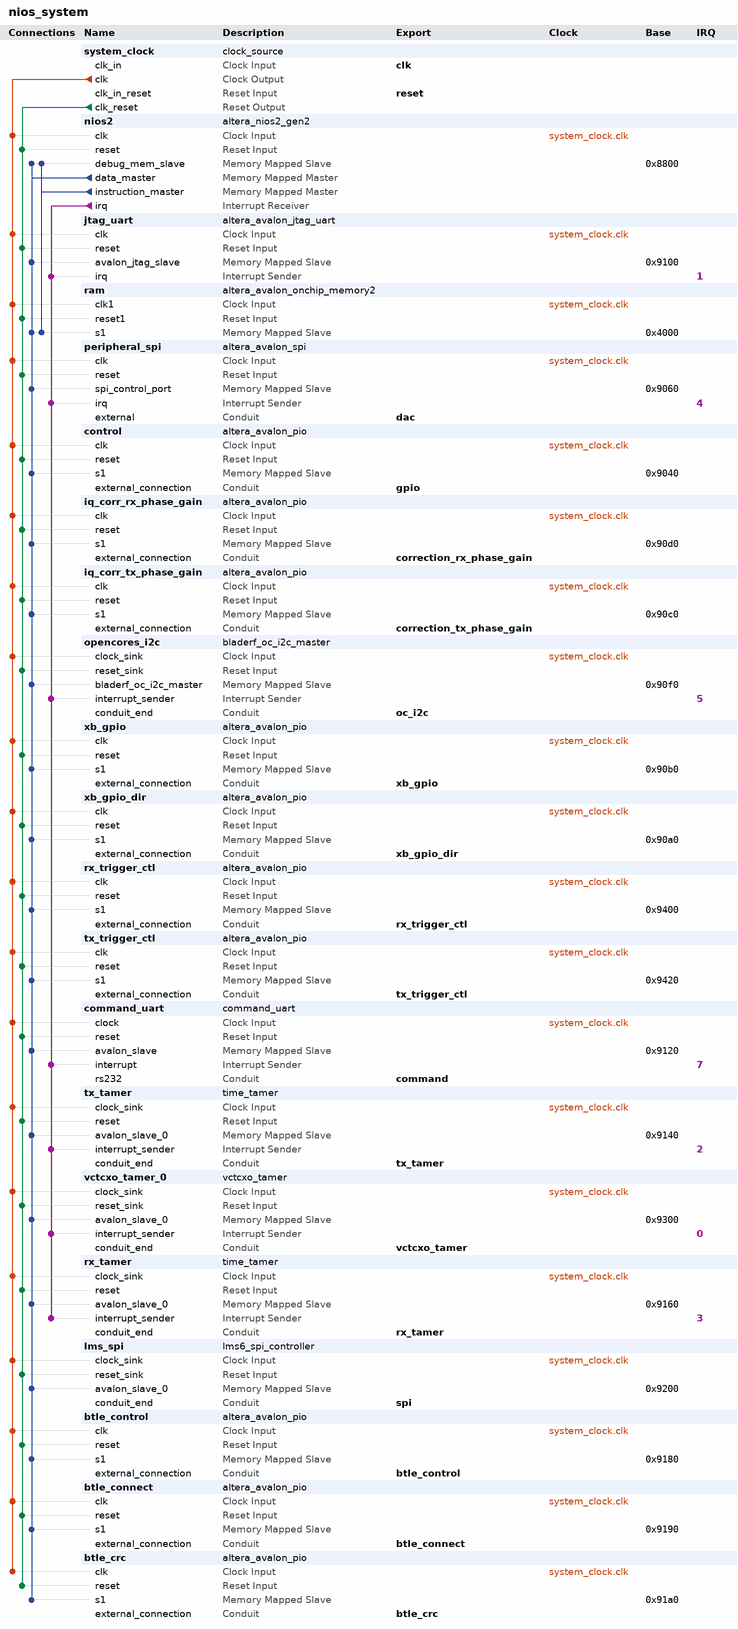
[diagram p0: system contents]
# Platform Designer (Qsys) system nios_system, Cyclone IV E EP4CE115F23C8
# Parameters at their usual value, and those the tool derives, are not listed.
package require -exact qsys 15.0
create_system nios_system
set_project_property DEVICE_FAMILY {Cyclone IV E}
set_project_property DEVICE EP4CE115F23C8

add_instance system_clock clock_source 15.0
set_instance_parameter_value system_clock clockFrequency 80000000
set_instance_parameter_value system_clock resetSynchronousEdges DEASSERT

add_instance nios2 altera_nios2_gen2 15.0
set_instance_parameter_value nios2 dcache_size 2048
set_instance_parameter_value nios2 dividerType srt2
set_instance_parameter_value nios2 exceptionSlave ram.s1
set_instance_parameter_value nios2 icache_size 2048
set_instance_parameter_value nios2 impl Tiny
set_instance_parameter_value nios2 mul_64_impl 1
set_instance_parameter_value nios2 mul_shift_choice 1
set_instance_parameter_value nios2 resetSlave ram.s1
set_instance_parameter_value nios2 setting_activateTrace true

add_instance jtag_uart altera_avalon_jtag_uart 15.0
set_instance_parameter_value jtag_uart simInteractiveOptions INTERACTIVE_INPUT_OUTPUT

add_instance ram altera_avalon_onchip_memory2 15.0
set_instance_parameter_value ram allowInSystemMemoryContentEditor true
set_instance_parameter_value ram dataWidth 32
set_instance_parameter_value ram dualPort false
set_instance_parameter_value ram initMemContent true
set_instance_parameter_value ram initializationFileName onchip_memory2_0
set_instance_parameter_value ram instanceID MED
set_instance_parameter_value ram memorySize 16384

add_instance peripheral_spi altera_avalon_spi 15.0
set_instance_parameter_value peripheral_spi clockPhase 1
set_instance_parameter_value peripheral_spi clockPolarity 1
set_instance_parameter_value peripheral_spi dataWidth 8
set_instance_parameter_value peripheral_spi masterSPI true
set_instance_parameter_value peripheral_spi numberOfSlaves 2
set_instance_parameter_value peripheral_spi targetClockRate 9600000

add_instance control altera_avalon_pio 15.0
set_instance_parameter_value control bitModifyingOutReg true
set_instance_parameter_value control direction Output
set_instance_parameter_value control width 32

add_instance iq_corr_rx_phase_gain altera_avalon_pio 15.0
set_instance_parameter_value iq_corr_rx_phase_gain direction Output
set_instance_parameter_value iq_corr_rx_phase_gain width 32

add_instance iq_corr_tx_phase_gain altera_avalon_pio 15.0
set_instance_parameter_value iq_corr_tx_phase_gain direction Output
set_instance_parameter_value iq_corr_tx_phase_gain resetValue 1
set_instance_parameter_value iq_corr_tx_phase_gain width 32

add_instance opencores_i2c bladerf_oc_i2c_master 1.0
set_instance_parameter_value opencores_i2c ARST_LVL 1

add_instance xb_gpio altera_avalon_pio 15.0
set_instance_parameter_value xb_gpio direction InOut
set_instance_parameter_value xb_gpio width 32

add_instance xb_gpio_dir altera_avalon_pio 15.0
set_instance_parameter_value xb_gpio_dir direction Output
set_instance_parameter_value xb_gpio_dir width 32

add_instance rx_trigger_ctl altera_avalon_pio 15.0
set_instance_parameter_value rx_trigger_ctl bitModifyingOutReg true
set_instance_parameter_value rx_trigger_ctl direction InOut
set_instance_parameter_value rx_trigger_ctl width 8

add_instance tx_trigger_ctl altera_avalon_pio 15.0
set_instance_parameter_value tx_trigger_ctl bitModifyingOutReg true
set_instance_parameter_value tx_trigger_ctl direction InOut
set_instance_parameter_value tx_trigger_ctl width 8

add_instance command_uart command_uart 1.0

add_instance tx_tamer time_tamer 1.0

add_instance vctcxo_tamer_0 vctcxo_tamer 1.0

add_instance rx_tamer time_tamer 1.0

add_instance lms_spi lms6_spi_controller 1.0
set_instance_parameter_value lms_spi ADDR_WIDTH 8
set_instance_parameter_value lms_spi CLOCK_DIV 4
set_instance_parameter_value lms_spi DATA_WIDTH 8

add_instance btle_control altera_avalon_pio 15.0
set_instance_parameter_value btle_control direction Output
set_instance_parameter_value btle_control width 32

add_instance btle_connect altera_avalon_pio 15.0
set_instance_parameter_value btle_connect direction Output
set_instance_parameter_value btle_connect width 32

add_instance btle_crc altera_avalon_pio 15.0
set_instance_parameter_value btle_crc direction Output
set_instance_parameter_value btle_crc width 24

# connections
add_connection system_clock.clk btle_connect.clk clock
add_connection system_clock.clk btle_control.clk clock
add_connection system_clock.clk btle_crc.clk clock
add_connection system_clock.clk command_uart.clock clock
add_connection system_clock.clk control.clk clock
add_connection system_clock.clk iq_corr_rx_phase_gain.clk clock
add_connection system_clock.clk iq_corr_tx_phase_gain.clk clock
add_connection system_clock.clk jtag_uart.clk clock
add_connection system_clock.clk lms_spi.clock_sink clock
add_connection system_clock.clk nios2.clk clock
add_connection system_clock.clk opencores_i2c.clock_sink clock
add_connection system_clock.clk peripheral_spi.clk clock
add_connection system_clock.clk ram.clk1 clock
add_connection system_clock.clk rx_tamer.clock_sink clock
add_connection system_clock.clk rx_trigger_ctl.clk clock
add_connection system_clock.clk tx_tamer.clock_sink clock
add_connection system_clock.clk tx_trigger_ctl.clk clock
add_connection system_clock.clk vctcxo_tamer_0.clock_sink clock
add_connection system_clock.clk xb_gpio.clk clock
add_connection system_clock.clk xb_gpio_dir.clk clock
add_connection system_clock.clk_reset btle_connect.reset reset
add_connection system_clock.clk_reset btle_control.reset reset
add_connection system_clock.clk_reset btle_crc.reset reset
add_connection system_clock.clk_reset command_uart.reset reset
add_connection system_clock.clk_reset control.reset reset
add_connection system_clock.clk_reset iq_corr_rx_phase_gain.reset reset
add_connection system_clock.clk_reset iq_corr_tx_phase_gain.reset reset
add_connection system_clock.clk_reset jtag_uart.reset reset
add_connection system_clock.clk_reset lms_spi.reset_sink reset
add_connection system_clock.clk_reset nios2.reset reset
add_connection system_clock.clk_reset opencores_i2c.reset_sink reset
add_connection system_clock.clk_reset peripheral_spi.reset reset
add_connection system_clock.clk_reset ram.reset1 reset
add_connection system_clock.clk_reset rx_tamer.reset reset
add_connection system_clock.clk_reset rx_trigger_ctl.reset reset
add_connection system_clock.clk_reset tx_tamer.reset reset
add_connection system_clock.clk_reset tx_trigger_ctl.reset reset
add_connection system_clock.clk_reset vctcxo_tamer_0.reset_sink reset
add_connection system_clock.clk_reset xb_gpio.reset reset
add_connection system_clock.clk_reset xb_gpio_dir.reset reset
add_connection nios2.data_master btle_connect.s1 avalon
set_connection_parameter_value nios2.data_master/btle_connect.s1 baseAddress 0x9190
add_connection nios2.data_master btle_control.s1 avalon
set_connection_parameter_value nios2.data_master/btle_control.s1 baseAddress 0x9180
add_connection nios2.data_master btle_crc.s1 avalon
set_connection_parameter_value nios2.data_master/btle_crc.s1 baseAddress 0x91a0
add_connection nios2.data_master command_uart.avalon_slave avalon
set_connection_parameter_value nios2.data_master/command_uart.avalon_slave baseAddress 0x9120
add_connection nios2.data_master control.s1 avalon
set_connection_parameter_value nios2.data_master/control.s1 baseAddress 0x9040
add_connection nios2.data_master iq_corr_rx_phase_gain.s1 avalon
set_connection_parameter_value nios2.data_master/iq_corr_rx_phase_gain.s1 baseAddress 0x90d0
add_connection nios2.data_master iq_corr_tx_phase_gain.s1 avalon
set_connection_parameter_value nios2.data_master/iq_corr_tx_phase_gain.s1 baseAddress 0x90c0
add_connection nios2.data_master jtag_uart.avalon_jtag_slave avalon
set_connection_parameter_value nios2.data_master/jtag_uart.avalon_jtag_slave baseAddress 0x9100
add_connection nios2.data_master lms_spi.avalon_slave_0 avalon
set_connection_parameter_value nios2.data_master/lms_spi.avalon_slave_0 baseAddress 0x9200
add_connection nios2.data_master nios2.debug_mem_slave avalon
set_connection_parameter_value nios2.data_master/nios2.debug_mem_slave baseAddress 0x8800
add_connection nios2.data_master opencores_i2c.bladerf_oc_i2c_master avalon
set_connection_parameter_value nios2.data_master/opencores_i2c.bladerf_oc_i2c_master baseAddress 0x90f0
add_connection nios2.data_master peripheral_spi.spi_control_port avalon
set_connection_parameter_value nios2.data_master/peripheral_spi.spi_control_port baseAddress 0x9060
add_connection nios2.data_master ram.s1 avalon
set_connection_parameter_value nios2.data_master/ram.s1 baseAddress 0x4000
add_connection nios2.data_master rx_tamer.avalon_slave_0 avalon
set_connection_parameter_value nios2.data_master/rx_tamer.avalon_slave_0 baseAddress 0x9160
add_connection nios2.data_master rx_trigger_ctl.s1 avalon
set_connection_parameter_value nios2.data_master/rx_trigger_ctl.s1 baseAddress 0x9400
add_connection nios2.data_master tx_tamer.avalon_slave_0 avalon
set_connection_parameter_value nios2.data_master/tx_tamer.avalon_slave_0 baseAddress 0x9140
add_connection nios2.data_master tx_trigger_ctl.s1 avalon
set_connection_parameter_value nios2.data_master/tx_trigger_ctl.s1 baseAddress 0x9420
add_connection nios2.data_master vctcxo_tamer_0.avalon_slave_0 avalon
set_connection_parameter_value nios2.data_master/vctcxo_tamer_0.avalon_slave_0 baseAddress 0x9300
add_connection nios2.data_master xb_gpio.s1 avalon
set_connection_parameter_value nios2.data_master/xb_gpio.s1 baseAddress 0x90b0
add_connection nios2.data_master xb_gpio_dir.s1 avalon
set_connection_parameter_value nios2.data_master/xb_gpio_dir.s1 baseAddress 0x90a0
add_connection nios2.instruction_master nios2.debug_mem_slave avalon
set_connection_parameter_value nios2.instruction_master/nios2.debug_mem_slave baseAddress 0x8800
add_connection nios2.instruction_master ram.s1 avalon
set_connection_parameter_value nios2.instruction_master/ram.s1 baseAddress 0x4000
add_connection nios2.irq command_uart.interrupt interrupt
set_connection_parameter_value nios2.irq/command_uart.interrupt irqNumber 7
add_connection nios2.irq jtag_uart.irq interrupt
set_connection_parameter_value nios2.irq/jtag_uart.irq irqNumber 1
add_connection nios2.irq opencores_i2c.interrupt_sender interrupt
set_connection_parameter_value nios2.irq/opencores_i2c.interrupt_sender irqNumber 5
add_connection nios2.irq peripheral_spi.irq interrupt
set_connection_parameter_value nios2.irq/peripheral_spi.irq irqNumber 4
add_connection nios2.irq rx_tamer.interrupt_sender interrupt
set_connection_parameter_value nios2.irq/rx_tamer.interrupt_sender irqNumber 3
add_connection nios2.irq tx_tamer.interrupt_sender interrupt
set_connection_parameter_value nios2.irq/tx_tamer.interrupt_sender irqNumber 2
add_connection nios2.irq vctcxo_tamer_0.interrupt_sender interrupt
set_connection_parameter_value nios2.irq/vctcxo_tamer_0.interrupt_sender irqNumber 0

# exported interfaces
add_interface btle_connect conduit end
set_interface_property btle_connect EXPORT_OF btle_connect.external_connection
add_interface btle_control conduit end
set_interface_property btle_control EXPORT_OF btle_control.external_connection
add_interface btle_crc conduit end
set_interface_property btle_crc EXPORT_OF btle_crc.external_connection
add_interface clk clock sink
set_interface_property clk EXPORT_OF system_clock.clk_in
add_interface command conduit end
set_interface_property command EXPORT_OF command_uart.rs232
add_interface correction_rx_phase_gain conduit end
set_interface_property correction_rx_phase_gain EXPORT_OF iq_corr_rx_phase_gain.external_connection
add_interface correction_tx_phase_gain conduit end
set_interface_property correction_tx_phase_gain EXPORT_OF iq_corr_tx_phase_gain.external_connection
add_interface dac conduit end
set_interface_property dac EXPORT_OF peripheral_spi.external
add_interface gpio conduit end
set_interface_property gpio EXPORT_OF control.external_connection
add_interface oc_i2c conduit end
set_interface_property oc_i2c EXPORT_OF opencores_i2c.conduit_end
add_interface reset reset sink
set_interface_property reset EXPORT_OF system_clock.clk_in_reset
add_interface rx_tamer conduit end
set_interface_property rx_tamer EXPORT_OF rx_tamer.conduit_end
add_interface rx_trigger_ctl conduit end
set_interface_property rx_trigger_ctl EXPORT_OF rx_trigger_ctl.external_connection
add_interface spi conduit end
set_interface_property spi EXPORT_OF lms_spi.conduit_end
add_interface tx_tamer conduit end
set_interface_property tx_tamer EXPORT_OF tx_tamer.conduit_end
add_interface tx_trigger_ctl conduit end
set_interface_property tx_trigger_ctl EXPORT_OF tx_trigger_ctl.external_connection
add_interface vctcxo_tamer conduit end
set_interface_property vctcxo_tamer EXPORT_OF vctcxo_tamer_0.conduit_end
add_interface xb_gpio conduit end
set_interface_property xb_gpio EXPORT_OF xb_gpio.external_connection
add_interface xb_gpio_dir conduit end
set_interface_property xb_gpio_dir EXPORT_OF xb_gpio_dir.external_connection

set_interconnect_requirement {$system} qsys_mm.clockCrossingAdapter HANDSHAKE
set_interconnect_requirement {$system} qsys_mm.maxAdditionalLatency 1

save_system nios_system.qsys
